# Altium schematic sheet NAVA0.01.SchDoc
size A; SheetNumber: 1; SheetTotal: 1
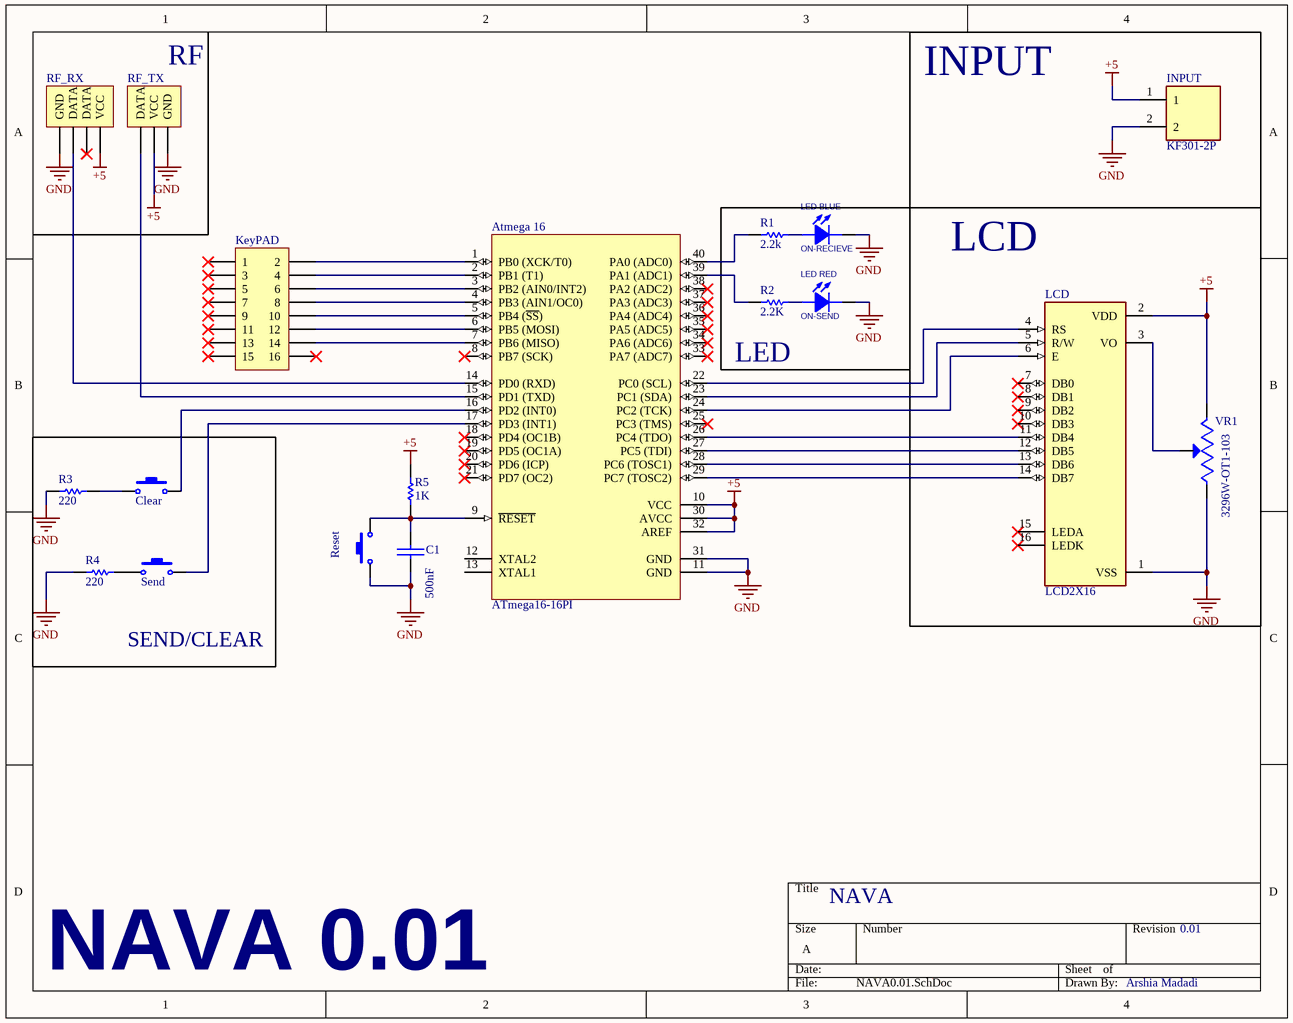
[diagram p0: NAVA0.01.SchDoc]

## Parts
Atmega_16  ATmega16-16PI  [My_40P6]
C1  500nF  [Cap - 100nF - 400V]
Clear  Switch PB  [Switch - Push to On]  (value not drawn)
INPUT  KF301-2P  [HANDSON_KF301-2P]
KeyPAD  Header 8X2  [My_2X08]  (value not drawn)
LCD  LCD2X16  [LCD_LCD2X16]
LED_BLUE  ON-RECIEVE  [LED5MM_BLUE]
LED_RED  ON-SEND  [LED5MM_RED]
R1  2.2k  [RES-(1/1)]
R2  2.2K  [RES-(1/1)]
R3  220  [RES-(1/1)]
R4  220  [RES-(1/1)]
R5  1K  [RES-(1/1)]
Reset  Switch PB  [Switch - Push to On]  (value not drawn)
RF_RX  Header 4  [My_1X04]  (value not drawn)
RF_TX  Header 3  [My_1X03]  (value not drawn)
Send  Switch PB  [Switch - Push to On]  (value not drawn)
VR1  3296W-OT1-103  [TRIM_3296W-OT1-103]

## Blocks framed on the sheet
LCD: LCD VR1
SEND/CLEAR: Clear R3 R4 Send

## Nets
+5: Atmega_16.10(VCC) Atmega_16.30(AVCC) Atmega_16.32(AREF) INPUT.1 LCD.2(VDD) R5.2 RF_RX.4(VCC) RF_TX.2(VCC) VR1.3(CW)
GND: Atmega_16.11(GND) Atmega_16.31(GND) C1.2(-) INPUT.2 LCD.1(VSS) LED_BLUE.2(CATHODE) LED_RED.2(CATHODE) R3.1 R4.1 Reset.1 RF_RX.1(GND) RF_TX.3(GND) VR1.1(CCW)
NetAtmega_16_1: Atmega_16.1(PB0_(XCK/T0)) KeyPAD.2
NetAtmega_16_2: Atmega_16.2(PB1_(T1)) KeyPAD.4
NetAtmega_16_3: Atmega_16.3(PB2_(AIN0/INT2)) KeyPAD.6
NetAtmega_16_4: Atmega_16.4(PB3_(AIN1/OC0)) KeyPAD.8
NetAtmega_16_5: Atmega_16.5(PB4_(~{SS})) KeyPAD.10
NetAtmega_16_6: Atmega_16.6(PB5_(MOSI)) KeyPAD.12
NetAtmega_16_7: Atmega_16.7(PB6_(MISO)) KeyPAD.14
NetAtmega_16_9: Atmega_16.9(~{RESET}) C1.1(+) R5.1 Reset.2
NetAtmega_16_14: Atmega_16.14(PD0_(RXD)) RF_RX.2(DATA)
NetAtmega_16_15: Atmega_16.15(PD1_(TXD)) RF_TX.1(DATA)
NetAtmega_16_16: Atmega_16.16(PD2_(INT0)) Clear.2
NetAtmega_16_17: Atmega_16.17(PD3_(INT1)) Send.2
NetAtmega_16_22: Atmega_16.22(PC0_(SCL)) LCD.4(RS)
NetAtmega_16_23: Atmega_16.23(PC1_(SDA)) LCD.5(R/W)
NetAtmega_16_24: Atmega_16.24(PC2_(TCK)) LCD.6(E)
NetAtmega_16_26: Atmega_16.26(PC4_(TDO)) LCD.11(DB4)
NetAtmega_16_27: Atmega_16.27(PC5_(TDI)) LCD.12(DB5)
NetAtmega_16_28: Atmega_16.28(PC6_(TOSC1)) LCD.13(DB6)
NetAtmega_16_29: Atmega_16.29(PC7_(TOSC2)) LCD.14(DB7)
NetAtmega_16_39: Atmega_16.39(PA1_(ADC1)) R2.1
NetAtmega_16_40: Atmega_16.40(PA0_(ADC0)) R1.1
NetClear_1: Clear.1 R3.2
NetLCD_3: LCD.3(VO) VR1.2(WIPER)
NetLED_BLUE_1: LED_BLUE.1(ANODE) R1.2
NetLED_RED_1: LED_RED.1(ANODE) R2.2
NetR4_2: R4.2 Send.1

Not connected (* = marked no-connect by the designer): Atmega_16 8(PB7_(SCK))* 12(XTAL2) 13(XTAL1) 18(PD4_(OC1B))* 19(PD5_(OC1A))* 20(PD6_(ICP))* 21(PD7_(OC2))* 25(PC3_(TMS))* 33(PA7_(ADC7))* 34(PA6_(ADC6))* 35(PA5_(ADC5))* 36(PA4_(ADC4))* 37(PA3_(ADC3))* 38(PA2_(ADC2))*; KeyPAD 1* 3* 5* 7* 9* 11* 13* 15* 16*; LCD 7(DB0)* 8(DB1)* 9(DB2)* 10(DB3)* 15(LEDA)* 16(LEDK)*; RF_RX 3(DATA)*

## Notes on the sheet
- RF
- INPUT
- LED
- NAVA
- 0.01
- NAVA 0.01
- Arshia Madadi

## Library data of the parts
Atmega_16 = ATmega16-16PI: AVR 16K Bytes of In-System Programmable Flash Memory; Published: 17-Sep-2003; LatestRevisionDate: 04-Mar-2005; LatestRevisionNote: Stylized 3D Model Added.; DatasheetVersion: 2466E-AVR-10/02; PackageVersion: Dec-1999; PackageReference: 40P6; Publisher: Altium Limited; PackageDescription: DIP; 40 Leads; Row Spacing 15.24 mm; Pitch 2.54 mm; ComponentLink1Description: Manufacturer Link; ComponentLink1URL: http://www.atmel.com; ComponentLink2Description: Datasheet; ComponentLink2URL: http://www.atmel.com/dyn/resources/prod_documents/doc2466.pdf
C1 = Cap-Bipolar: Bipolar Capacitor; Voltage: 100V; Designer: Saeid Jorablo; Organazation: ControTec; Adding Date: 1387/12/20; Value: 500nF
Clear Reset Send = Switch PB: Push Button Switch
INPUT = KF301-2P: 2 Pin Terminal Block 5mm Pitch; Price: None; Value: *; MP: KF301-2P; Package: None; Availability: Unavailable
KeyPAD = Header 8X2: Header, 8-Pin, Dual row; LatestRevisionDate: 17-Jul-2002; LatestRevisionNote: Re-released for DXP Platform.; Publisher: Altium Limited
LCD = LCD2X16: Display; Display: LCD 2x16 characters (blue backlight); Price: None; Value: *; MP: LCD2X16; Package: None; Availability: Unavailable
LED_BLUE LED_RED = LED 5MM: Light Emitting Diode; Designer: Abbas Basereh; Data: 16-12-2016; Link: *; Part.No: *
R1-R5 = RES DIP PACKAGE: TOTAL DIP RESISTOR PACK; Designer: Ali Hafizi
RF_RX = Header 4: Header, 4-Pin; LatestRevisionDate: 17-Jul-2002; LatestRevisionNote: Re-released for DXP Platform.; Publisher: Altium Limited
RF_TX = Header 3: Header, 3-Pin; LatestRevisionDate: 17-Jul-2002; LatestRevisionNote: Re-released for DXP Platform.; Publisher: Altium Limited
VR1 = 3296W-OT1-103: Potentiometers, multi, Resistors, trimmer, cermet, potentiometers, turn, sealed, Potentiometers and Accessories, Pass...; MF: Bourns; SnapEDA_Link: https://www.snapeda.com/parts/3296W-OT1-103/Bourns/view-part/?ref=snap; Package: SOT-23-5 Bourns; MP: 3296W-OT1-103; Check_prices: https://www.snapeda.com/parts/3296W-OT1-103/Bourns/view-part/?ref=eda; Price: None; Value: *; Availability: Not in stock